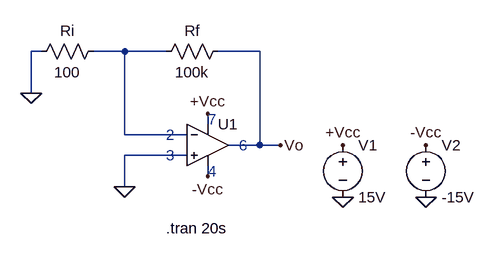
[diagram p0: schematic Input Offset Voltage.asc]
Input Offset Voltage.asc, the LTspice schematic file:
Version 4
SHEET 1 880 680
WIRE 48 192 32 192
WIRE 176 192 128 192
WIRE 240 192 176 192
WIRE 384 192 320 192
WIRE 32 256 32 192
WIRE 304 304 304 288
WIRE 176 320 176 192
WIRE 272 320 176 320
WIRE 384 336 384 192
WIRE 384 336 336 336
WIRE 416 336 384 336
WIRE 272 352 176 352
WIRE 304 384 304 368
WIRE 176 400 176 352
FLAG 512 416 0
FLAG 640 416 0
FLAG 512 336 +Vcc
FLAG 640 336 -Vcc
FLAG 304 288 +Vcc
FLAG 304 384 -Vcc
FLAG 416 336 Vo
FLAG 176 400 0
FLAG 32 256 0
SYMBOL OpAmps/UniversalOpAmp 304 336 R0
SYMATTR InstName U1
SYMBOL Voltage 512 320 R0
SYMATTR InstName V1
SYMATTR Value 15V
SYMBOL Voltage 640 320 R0
SYMATTR InstName V2
SYMATTR Value -15V
SYMBOL Res 336 176 R90
WINDOW 0 0 56 VBottom 2
WINDOW 3 32 56 VTop 2
SYMATTR InstName Rf
SYMATTR Value 100k
SYMBOL Res 144 176 R90
WINDOW 0 0 56 VBottom 2
WINDOW 3 32 56 VTop 2
SYMATTR InstName Ri
SYMATTR Value 100
TEXT 304 376 Left 2 ;4
TEXT 304 296 Left 2 ;7
TEXT 352 336 Left 2 ;6
TEXT 240 320 Left 2 ;2
TEXT 240 352 Left 2 ;3
TEXT 240 464 Left 2 !.tran 20s

The netlist it stands for:
* Input Offset Voltage.asc
XU1 0 N001 +Vcc -Vcc Vo level1 Avol=1Meg GBW=10Meg Vos=0 En=0 Enk=0 In=0 Ink=0 Rin=500Meg  ; pins In+ In- V+ V- OUT
V1 +Vcc 0 15V
V2 -Vcc 0 -15V
Rf Vo N001 100k
Ri N001 0 100
* 4
* 7
* 6
* 2
* 3
.tran 20s
.lib UniversalOpAmp1.lib
.backanno
.end